# EAGLE design VCF-LM358-Stereo (EAGLE 7.6.0)
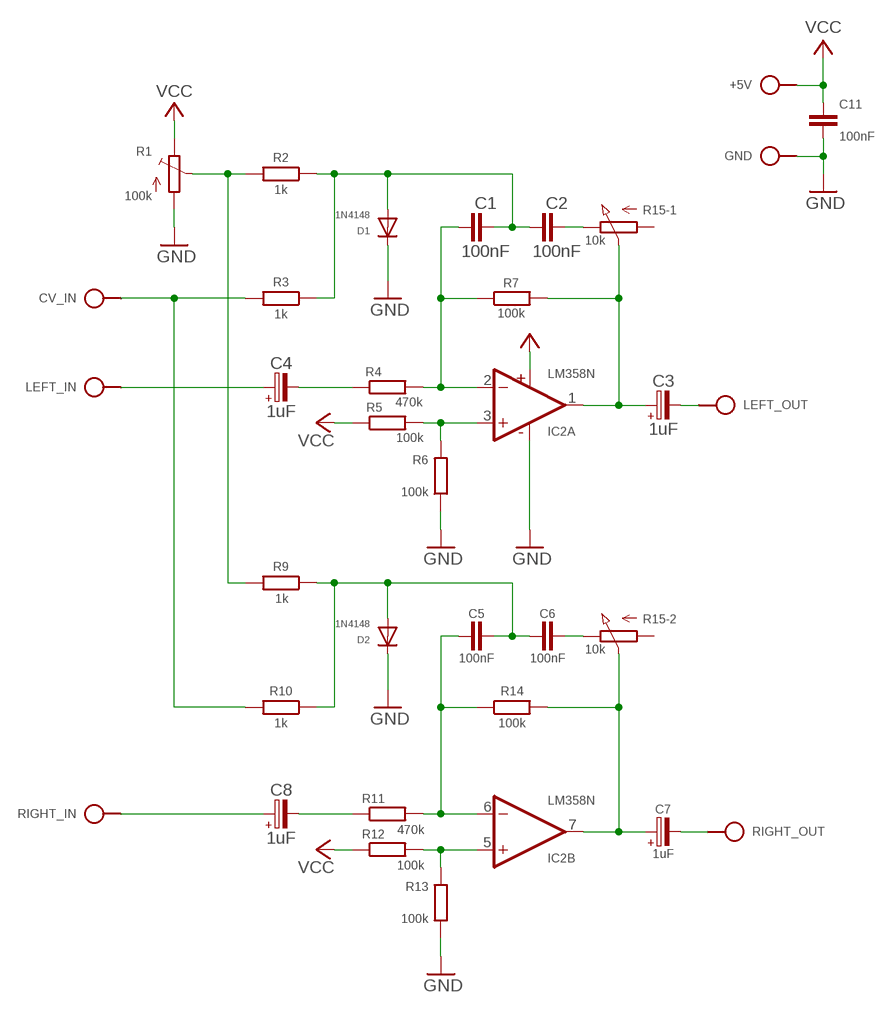
[diagram p0: schematic, sheet 1]

## Parts
+5V  VCC  SPAD  [SPAD]
C1  100nF  C050-024X044  [C050-024X044]
C2  100nF  C050-024X044  [C050-024X044]
C3  1uF  CPOLE2,5-3  [E2,5-3]
C4  1uF  CPOLE2,5-3  [E2,5-3]
C5  100nF  C050-024X044  [C050-024X044]
C6  100nF  C050-024X044  [C050-024X044]
C7  1uF  CPOLE2,5-3  [E2,5-3]
C8  1uF  CPOLE2,5-3  [E2,5-3]
C11  100nF  C050-020X036  [C050-020X036]
CV_IN  CV_IN  SPAD  [SPAD]
D1  1N4148  1N414834-10V  [DO34-10V]
D2  1N4148  1N414834-7V  [DO34-7V]
GND  GND  SPAD  [SPAD]
IC2  LM358N  [DIL08]
LEFT_IN  AUDIO_IN  SPAD  [SPAD]
LEFT_OUT  AUDIO_OUT  SPAD  [SPAD]
R1  100k  TRIM  [B64Y]
R2  1k  R0202/7  [0202/7]
R3  1k  R0202/7  [0202/7]
R4  470k  R0202/7  [0202/7]
R5  100k  R0202/7  [0202/7]
R6  100k  R0202/7  [0202/7]
R7  100k  R0202/7  [0202/7]
R9  1k  R0202/7  [0202/7]
R10  1k  R0202/7  [0202/7]
R11  470k  R0202/7  [0202/7]
R12  100k  R0202/7  [0202/7]
R13  100k  R0202/7  [0202/7]
R14  100k  R0202/7  [0202/7]
R15  10k  POT-STEREO  [POT-STEREO]
RIGHT_IN  AUDIO_IN  SPAD  [SPAD]
RIGHT_OUT  AUDIO_OUT  SPAD  [SPAD]

## Nets
GND: C11.2 D1.C D2.C GND.1 IC2.4(P:V-) R1.A R6.1 R13.1
N$1: C4.+ LEFT_IN.1
N$2: C1.1 IC2.2(A:-IN) R4.2 R7.1
N$3: C2.2 R15.1-3(-1:E)
N$4: C3.+ IC2.1(A:OUT) R7.2 R15.1-2(-1:S)
N$5: R1.S R2.2 R9.2
N$6: C3.- LEFT_OUT.1
N$7: IC2.3(A:+IN) R5.2 R6.2
N$8: CV_IN.1 R3.2 R10.2
N$9: C1.2 C2.1 D1.A R2.1 R3.1
N$10: C4.- R4.1
N$11: C6.2 R15.2-3(-2:E)
N$12: C7.+ IC2.7(B:OUT) R14.2 R15.2-2(-2:S)
N$13: IC2.5(B:+IN) R12.2 R13.2
N$16: C5.2 C6.1 D2.A R9.1 R10.1
N$17: C5.1 IC2.6(B:-IN) R11.2 R14.1
N$18: C7.- RIGHT_OUT.1
N$19: C8.+ RIGHT_IN.1
N$20: C8.- R11.1
VCC: +5V.1 C11.1 IC2.8(P:V+) R1.E R5.1 R12.1
Unconnected: R15.1-1(-1:A) R15.2-1(-2:A)

## Library data of the parts
+5V CV_IN GND LEFT_IN LEFT_OUT RIGHT_IN RIGHT_OUT = pad:SPAD
C1 C2 C5 C6 C11 = c:C: CAPACITOR, European symbol
C3 C4 C7 C8 = c:CPOL: POLARIZED CAPACITOR, European symbol
D1 D2 = d:1N4148
IC2 = ic:LM358: OP AMP also LM158; LM258; LM2904 Source: http://cache.national.com/ds/LM/LM158.pdf
R1 = r:TRIM: POTENTIOMETER
R2-R7 R9-R14 = r:R: RESISTOR, European symbol
R15 = r:POT-STEREO

## Module LFO
Ports: TRI_OUT(io) GND(io) VCC(io)
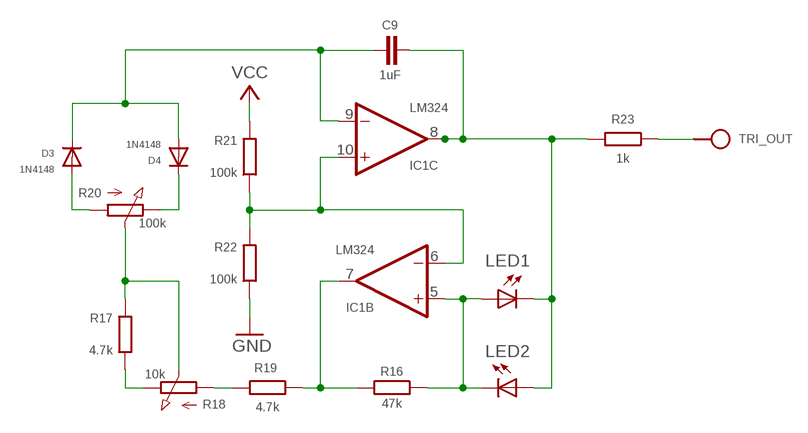
[diagram p1: schematic, module LFO, sheet 1]

### Parts
C9  1uF  C050-024X044/V  [C050-024X044/V]
D3  1N4148  1N414834-7V  [DO34-7V]
D4  1N4148  1N414834-7V  [DO34-7V]
IC1  LM324  LM324N  [DIL14]
LED1  LED3MM  [LED3MM]
LED2  LED3MM  [LED3MM]
R16  47k  R0202/7-V  [0202/7-V]
R17  4.7k  R0202/7  [0202/7]
R18  10k  POT  [POT]
R19  4.7k  R0202/7-V  [0202/7-V]
R20  100k  POT  [POT]
R21  100k  R0202/7-V  [0202/7-V]
R22  100k  R0202/7-V  [0202/7-V]
R23  1k  R0202/7-V  [0202/7-V]
TRI_OUT  TRIANGLE  SPAD  [SPAD]

### Nets
GND: R22.1
N$14: IC1.7(B:OUT) R16.2 R19.1
N$15: IC1.5(B:+IN) LED1.A LED2.K(C) R16.1
N$26: C9.1 D3.C D4.A IC1.9(C:-IN)
N$28: C9.2 IC1.8(C:OUT) LED1.K(C) LED2.A R23.2
OA_C_IN+: IC1.6(B:-IN) IC1.10(C:+IN) R21.1 R22.2
TRI_OUT: R23.1 TRI_OUT.1
TRIM_1_A: D3.A R20.1(A)
TRIM_1_B: D4.C R20.3(E)
TRIM_2_A: R17.1 R18.3(E)
TRIM_2_B: R18.1(A) R19.2
TRIM_P: R17.2 R18.2(S) R20.2(S)
VCC: R21.2
Unconnected: IC1.1(A:OUT) IC1.2(A:-IN) IC1.3(A:+IN) IC1.12(D:+IN) IC1.13(D:-IN) IC1.14(D:OUT)

### Power pins joined to a net without a drawn wire
V+: IC1.4(P:V+)
V-: IC1.11(P:V-)

### Library data of the parts
C9 = c:C: CAPACITOR, European symbol
D3 D4 = d:1N4148
IC1 = ic:LM324: OP AMP
LED1 LED2 = led:LED: LED OSRAM: - CHIPLED LG R971, LG N971, LY N971, LG Q971, LY Q971, LO R971, LY R971 LH N974, LH R974 LS Q976, LO Q976, LY Q976 LO Q996 - Hyper CHIPLED LW Q18S LB Q993, LB Q99A, LB R99A - SideLED LS A670, LO A670, LY A670, LG A670, LP A670 LB A673, LV A673, LT A673, LW A673 LH A674 LY A675 LS A676, LA A676, LO A676, LY A676, LW A676 LS A679, LY A679, LG A679 - Hyper Micro SIDELED® LS Y876, LA Y876, LO Y876, LY Y876 LT Y87S - SmartLED LW L88C, LW L88S LB L89C, LB L89S, LG L890 LS L89K, LO L89K, LY L89K LS L896, LA L896, LO L896, LY L896 - TOPLED LS T670, LO T670, LY T670, LG T670, LP T670 LSG T670, LSP T670, LSY T670, LOP T670, LYG T670 LG T671, LOG T671, LSG T671 LB T673, LV T673, LT T673, LW T673 LH T674 LS T676, LA T676, LO T676, LY T676, LB T676, LH T676, LSB T676, LW T676 LB T67C, LV T67C, LT T67C, LS T67K, LO T67K, LY T67K, LW E67C LS E67B, LA E67B, LO E67B, LY E67B, LB E67C, LV E67C, LT E67C LW T67C LS T679, LY T679, LG T679 LS T770, LO T770, LY T770, LG T770, LP T770 LB T773, LV T773, LT T773, LW T773 LH T774 LS E675, LA E675, LY E675, LS T675 LS T776, LA T776, LO T776, LY T776, LB T776 LHGB T686 LT T68C, LB T68C - Hyper Mini TOPLED® LB M676 - Mini TOPLED Santana® LG M470 LS M47K, LO M47K, LY M47K Source: http://www.osram.convergy.de LUXEON: - LUMILED® LXK2-PW12-R00, LXK2-PW12-S00, LXK2-PW14-U00, LXK2-PW14-V00 LXK2-PM12-R00, LXK2-PM12-S00, LXK2-PM14-U00 LXK2-PE12-Q00, LXK2-PE12-R00, LXK2-PE12-S00, LXK2-PE14-T00, LXK2-PE14-U00 LXK2-PB12-K00, LXK2-PB12-L00, LXK2-PB12-M00, LXK2-PB14-N00, LXK2-PB14-P00, LXK2-PB14-Q00 LXK2-PR12-L00, LXK2-PR12-M00, LXK2-PR14-Q00, LXK2-PR14-R00 LXK2-PD12-Q00, LXK2-PD12-R00, LXK2-PD12-S00 LXK2-PH12-R00, LXK2-PH12-S00 LXK2-PL12-P00, LXK2-PL12-Q00, LXK2-PL12-R00 Source: www.luxeon.com KINGBRIGHT: KA-3528ASYC Source: www.kingbright.com
R16 R17 R19 R21-R23 = r:R: RESISTOR, European symbol
R18 R20 = r:POT
TRI_OUT = pad:SPAD

## Module VCF-L
Ports: 

### Library data of the parts

## Board
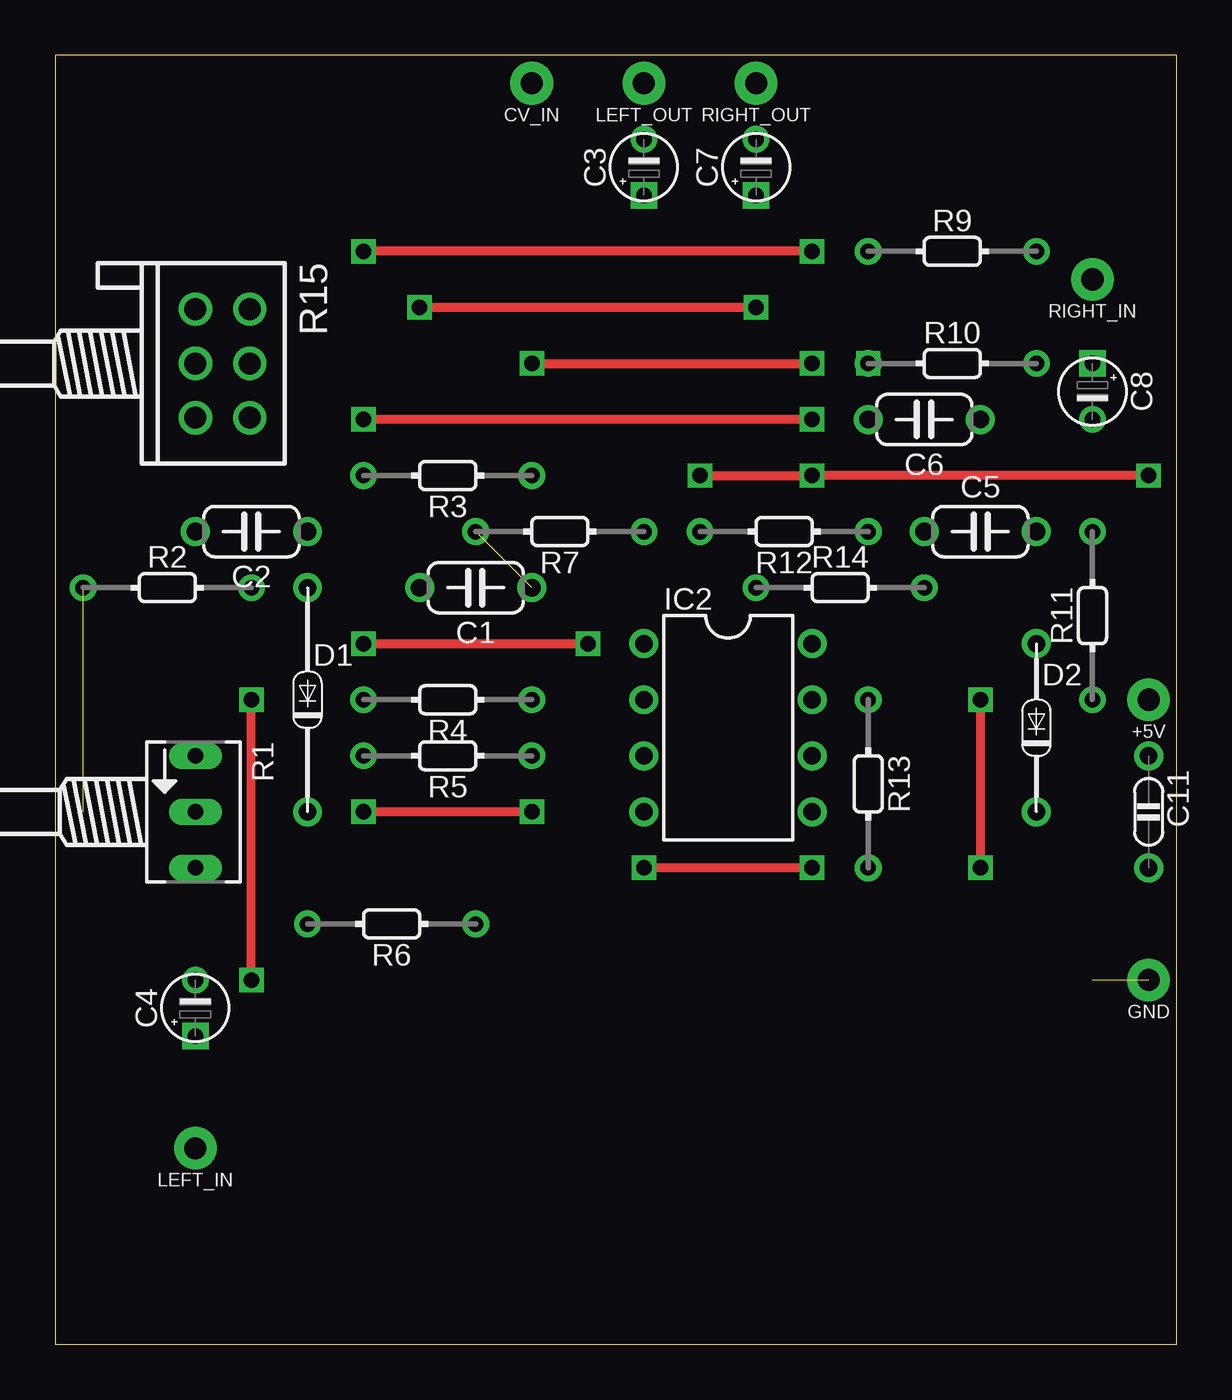
[diagram p2: board, top side]
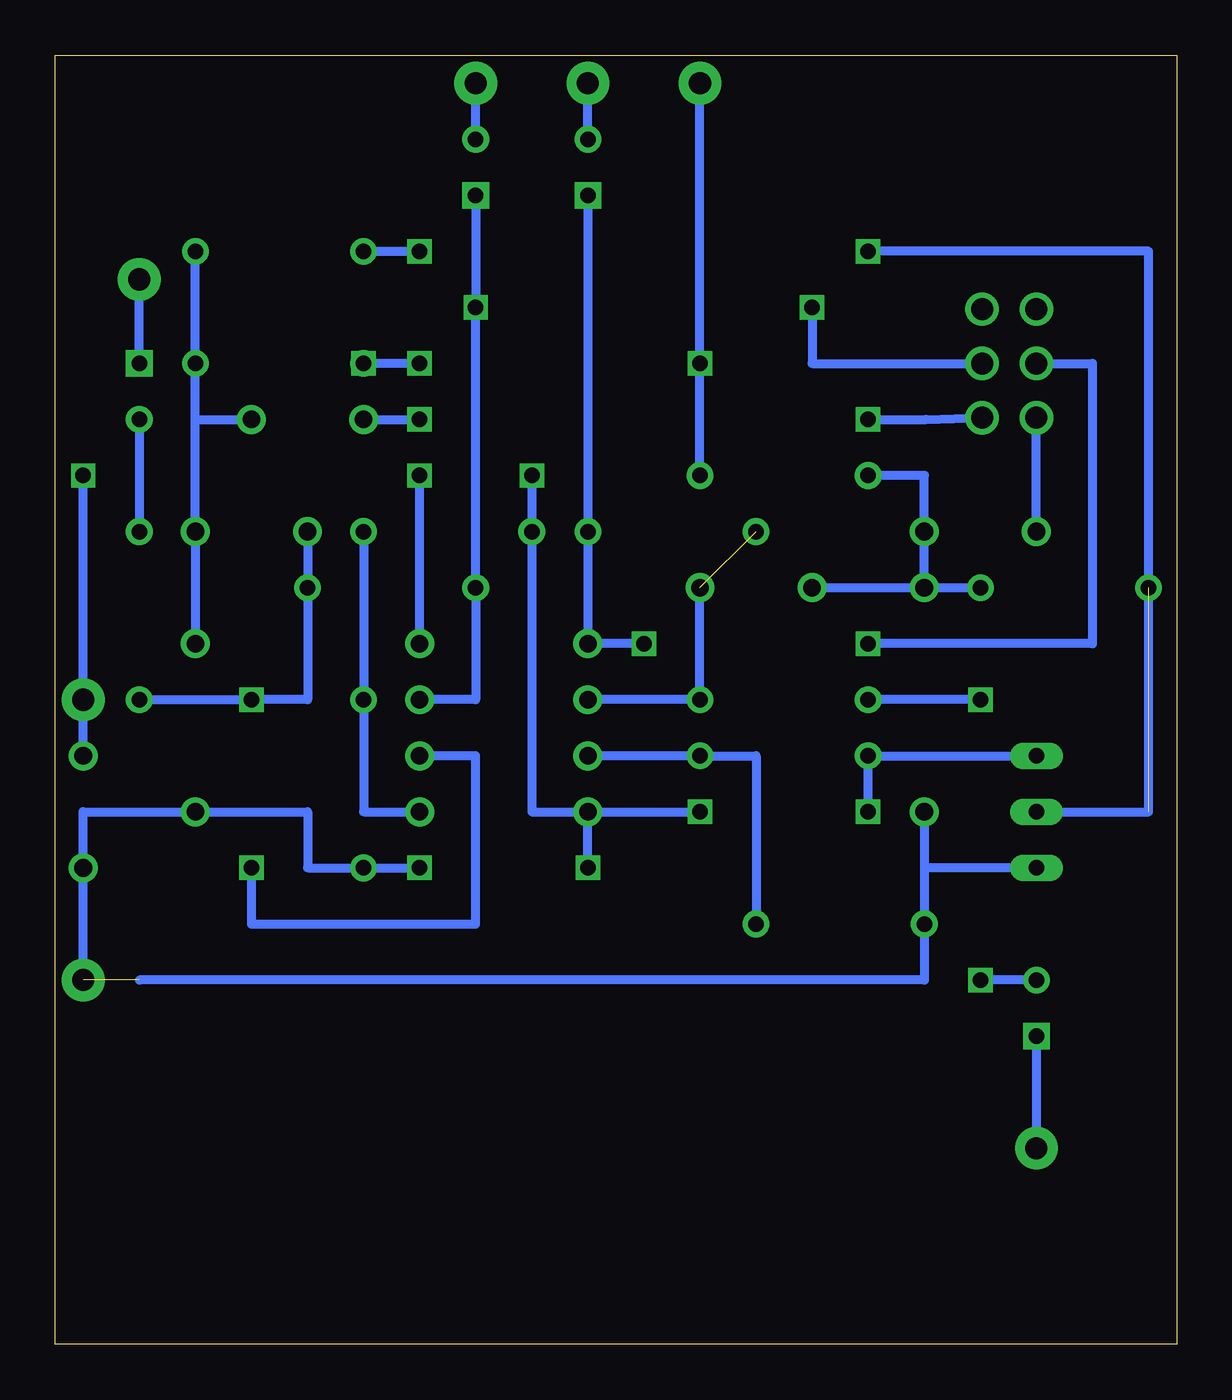
[diagram p3: board, bottom side, seen from below]

Size 50.8 x 58.42 mm. Coordinates in mm from the lower left corner, seen from the top.
Outline: 0,0 50.8,0 50.8,58.42 0,58.42 0,0
Copper layers (1*16): Top 0.035mm / dielectric 1.5mm / Bottom 0.035mm
Design rules "default": minimum track width 10mil, minimum drill 24mil, track to track 8mil, track to pad 8mil, pad to pad 8mil, via to via 8mil, smd to smd 8mil, copper to edge 40mil, drill to drill 8mil, minimum pad ring 10mil, minimum via ring 8mil, stop-mask expansion 4mil, vias tented up to drill 0mil, thermal gap 10mil

### Footprints (pad centres in the part's own frame; a part is rotated, then mirrored left to right if it is on the bottom)
SPAD = drill 1 pad 1.93: 1 0,0
C050-024X044 = drill 0.8: 1 -2.54,0; 2 2.54,0
E2,5-3 = drill 0.7 square: + 0,1.27 | drill 0.7: - 0,-1.27
C050-020X036 = drill 0.8: 1 -2.54,0; 2 2.54,0
DO34-10V = drill 0.8: A 0,5.08; C 0,-5.08
DO34-7V = drill 0.8: A 0,3.81; C 0,-3.81
DIL08 = drill 0.8 pad 1.27: 1 -3.81,-3.81; 2 -1.27,-3.81; 3 1.27,-3.81; 4 3.81,-3.81; 5 3.81,3.81; 6 1.27,3.81; 7 -1.27,3.81; 8 -3.81,3.81
B64Y = drill 0.7 long: A 2.54,0; E -2.54,0; S 0,0
0202/7 = drill 0.7: 1 0,3.81; 2 0,-3.81
POT-STEREO = drill 1: 1-1 -2.46,-2.54; 1-2 0,-2.54; 1-3 2.46,-2.54; 2-1 -2.46,-0.08; 2-2 0,-0.08; 2-3 2.46,-0.08

### Placement (x,y rotation side)
+5V  49.53,29.21 90 top
C1  19.05,34.29 180 top
C2  8.89,36.83 180 top
C3  26.67,53.34 180 top
C4  6.35,15.24 180 top
C5  41.91,36.83 0 top
C6  39.37,41.91 180 top
C7  31.75,53.34 180 top
C8  46.99,43.18 0 top
C11  49.53,24.13 270 top
CV_IN  21.59,57.15 90 top
D1  11.43,29.21 0 top
D2  44.45,27.94 0 top
GND  49.53,16.51 90 top
IC2  30.48,27.94 270 top
LEFT_IN  6.35,8.89 90 top
LEFT_OUT  26.67,57.15 90 top
R1  6.35,24.13 270 top
R2  5.08,34.29 270 top
R3  17.78,39.37 90 top
R4  17.78,29.21 90 top
R5  17.78,26.67 90 top
R6  15.24,19.05 90 top
R7  22.86,36.83 90 top
R9  40.64,49.53 270 top
R10  40.64,44.45 270 top
R11  46.99,33.02 0 top
R12  33.02,36.83 90 top
R13  36.83,25.4 180 top
R14  35.56,34.29 270 top
R15  8.89,44.45 270 top
RIGHT_IN  46.99,48.26 90 top
RIGHT_OUT  31.75,57.15 90 top

### Tracks (layer width: path | path; a pad name or v marks a point on that pad's centre or on a via)
GND  (via drill 0.7)  (2 unrouted)
  Top 0.406: v34.29,21.59 v26.67,21.59
  Bottom 0.406: v34.29,21.59 R13.1 39.37,21.59 39.37,24.13 D2.C 49.53,24.13 C11.2 GND.1 | D1.C R6.1 | R1.A 11.43,21.59 R6.1 | R6.1 11.43,16.51 46.99,16.51 | v26.67,21.59 IC2.4
N$1
  Bottom 0.406: C4.+ LEFT_IN.1
N$2  (1 unrouted)
  Bottom 0.406: C1.1 R4.2 IC2.2
N$3
  Bottom 0.406: C2.2 R15.1-3
N$4  (via drill 0.7)
  Top 0.406: v13.97,31.75 v24.13,31.75
  Bottom 0.406: C3.+ R7.2 IC2.1 v24.13,31.75 | R15.1-2 3.81,44.45 3.81,31.75 v13.97,31.75
N$5  (via drill 0.7)  (1 unrouted)
  Top 0.406: v34.29,49.53 v13.97,49.53
  Bottom 0.406: R1.S 1.27,24.13 1.27,49.53 v13.97,49.53 | R9.2 v34.29,49.53
N$6
  Bottom 0.406: C3.- LEFT_OUT.1
N$7
  Bottom 0.406: R6.2 19.05,26.67 R5.2 IC2.3
N$8  (via drill 0.7)
  Top 0.406: v21.59,44.45 v34.29,44.45
  Bottom 0.406: v21.59,44.45 R3.2 CV_IN.1 | v34.29,44.45 R10.2
  other vias: 36.83,44.45
N$9
  Bottom 0.406: C1.2 D1.A | D1.A C2.1 11.43,39.37 R3.1 | D1.A R2.1
N$10  (via drill 0.7)
  Top 0.406: v8.89,16.51 v8.89,29.21
  Bottom 0.406: C4.- v8.89,16.51 | v8.89,29.21 R4.1
N$11  (via drill 0.7)
  Top 0.406: v34.29,41.91 v13.97,41.91
  Bottom 0.406: C6.2 v34.29,41.91 | v13.97,41.91 11.35,41.91 R15.2-3
N$12  (via drill 0.7)
  Top 0.406: v31.75,46.99 v16.51,46.99
  Bottom 0.406: C7.+ v31.75,46.99 R14.2 31.75,29.21 IC2.7 | v16.51,46.99 16.51,44.45 R15.2-2
N$13
  Bottom 0.406: R12.2 R13.2 36.83,24.13 IC2.5
N$16
  Bottom 0.406: D2.A C5.2 44.45,41.91 | 44.45,41.91 R10.1 R9.1 | 44.45,41.91 C6.1
N$17  (via drill 0.7)
  Top 0.406: v41.91,29.21 v41.91,21.59
  Bottom 0.406: R11.2 v41.91,29.21 39.37,29.21 R14.1 C5.1 | v41.91,21.59 41.91,19.05 31.75,19.05 31.75,26.67 IC2.6
N$18
  Bottom 0.406: C7.- RIGHT_OUT.1
N$19
  Bottom 0.406: C8.+ RIGHT_IN.1
N$20
  Bottom 0.406: C8.- R11.1
VCC  (via drill 0.7)
  Top 0.406: v21.59,24.13 v13.97,24.13 | v49.53,39.37 v34.29,39.37 v29.21,39.37
  Bottom 0.406: v13.97,24.13 R5.1 R1.E | C11.1 +5V.1 v49.53,39.37 | v29.21,39.37 R12.1 29.21,24.13 v21.59,24.13 | IC2.8 v34.29,39.37